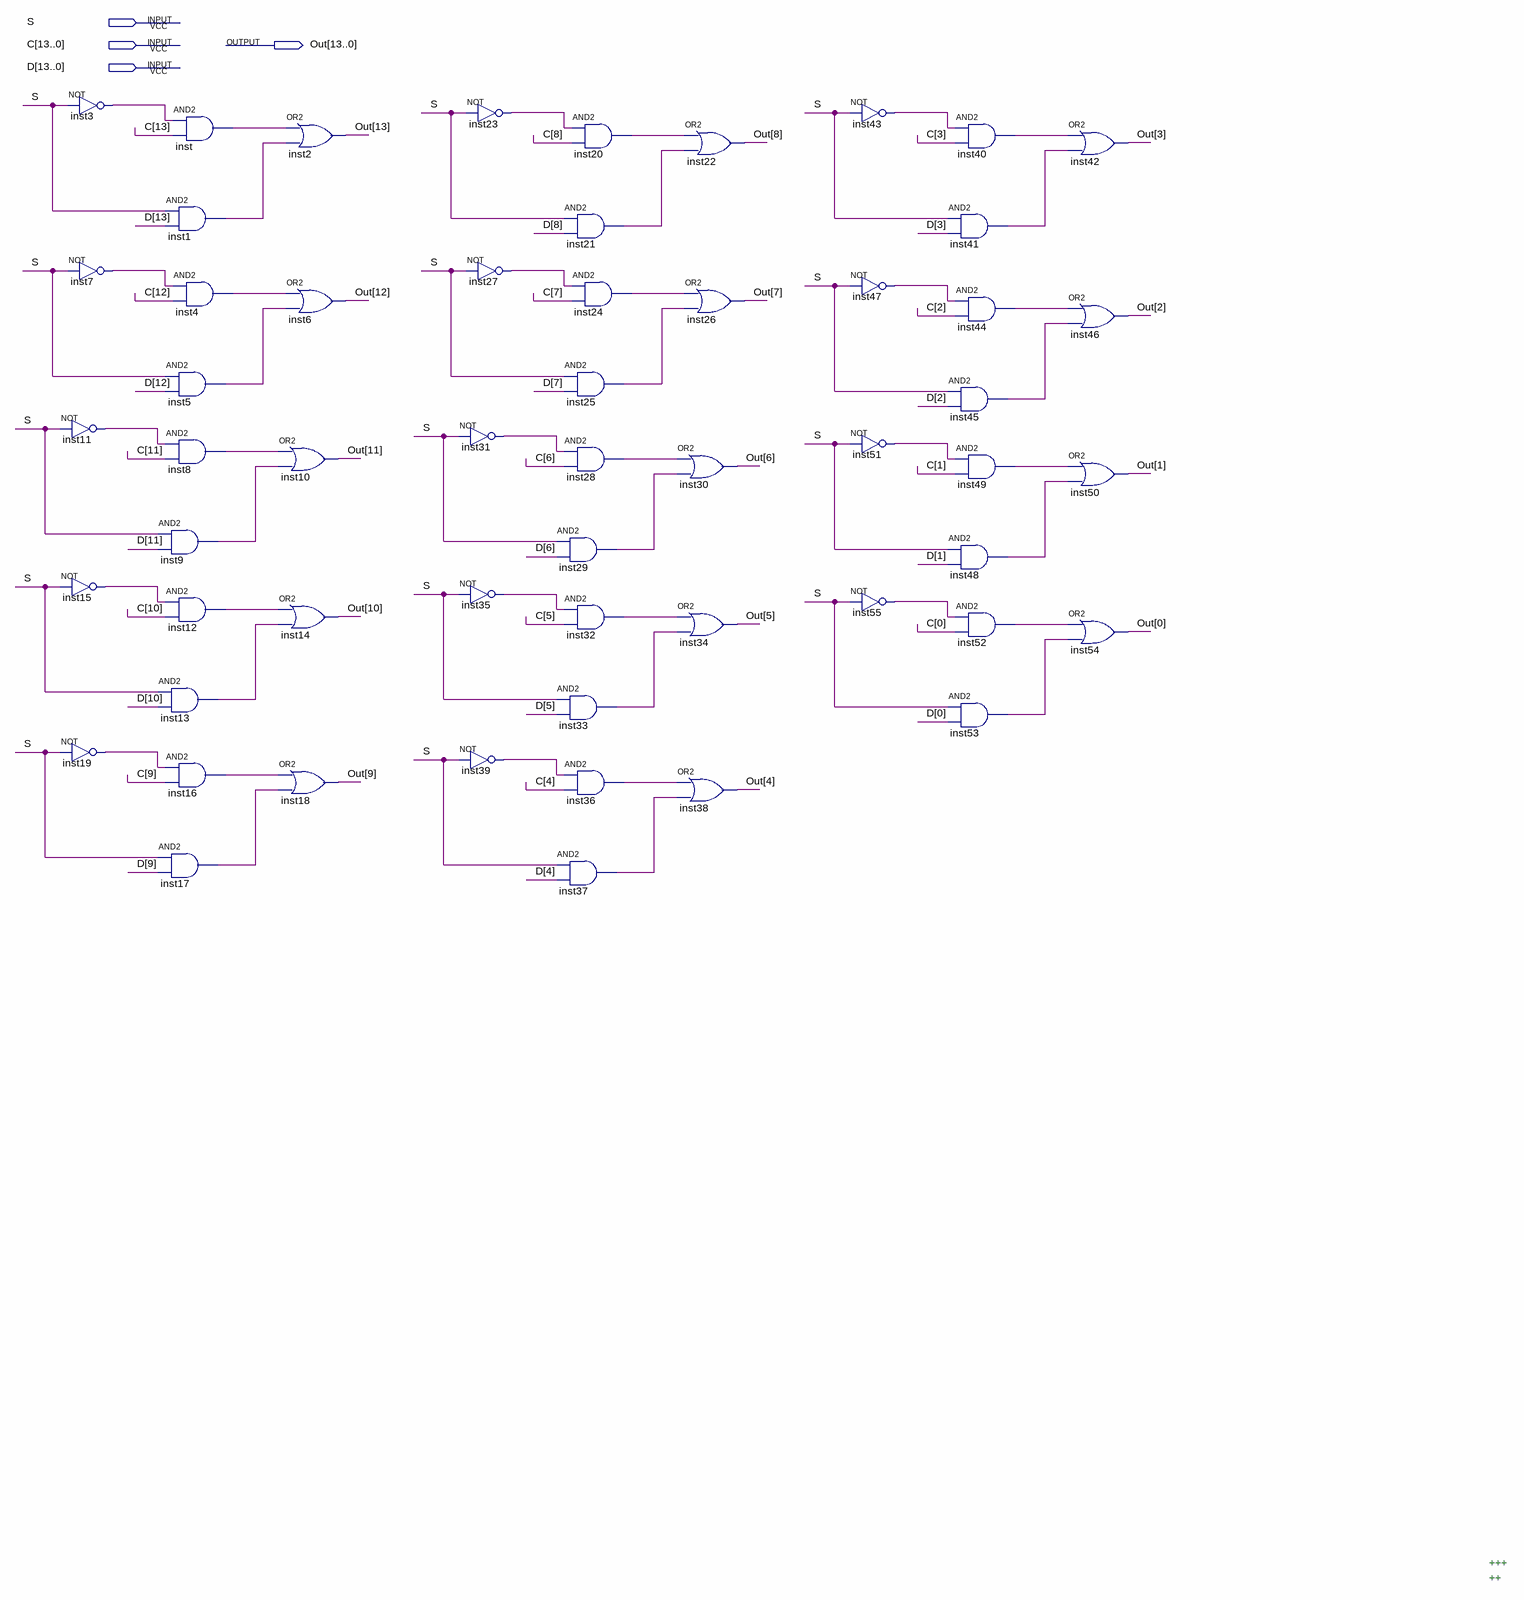
[diagram p0: schematic sheet]
// Quartus schematic g27_busmux.bdf as structural Verilog: 56 symbols, 4 pins
module g27_busmux (
  input  S,
  input  [13:0] C,
  input  [13:0] D,
  output [13:0] Out
);

  wire inst1_out, inst3_out, inst4_out, inst5_out, inst7_out, inst8_out, inst9_out, inst11_out, inst12_out,
       inst13_out, inst15_out, inst16_out, inst17_out, inst19_out, inst20_out, inst21_out, inst23_out,
       inst24_out, inst25_out, inst27_out, inst28_out, inst29_out, inst31_out, inst32_out, inst33_out,
       inst35_out, inst36_out, inst37_out, inst39_out, inst40_out, inst41_out, inst43_out, inst44_out,
       inst45_out, inst47_out, inst48_out, inst49_out, inst51_out, inst52_out, inst53_out, inst55_out,
       inst_out;

  not inst3 (inst3_out, S);
  not inst7 (inst7_out, S);
  not inst11 (inst11_out, S);
  not inst15 (inst15_out, S);
  not inst19 (inst19_out, S);
  and inst (inst_out, inst3_out, C[13]);
  and inst1 (inst1_out, S, D[13]);
  and inst4 (inst4_out, inst7_out, C[12]);
  and inst5 (inst5_out, S, D[12]);
  and inst8 (inst8_out, inst11_out, C[11]);
  and inst9 (inst9_out, S, D[11]);
  and inst12 (inst12_out, inst15_out, C[10]);
  and inst13 (inst13_out, S, D[10]);
  and inst16 (inst16_out, inst19_out, C[9]);
  and inst17 (inst17_out, S, D[9]);
  or inst2 (Out[13], inst_out, inst1_out);
  or inst6 (Out[12], inst4_out, inst5_out);
  or inst10 (Out[11], inst8_out, inst9_out);
  or inst14 (Out[10], inst12_out, inst13_out);
  or inst18 (Out[9], inst16_out, inst17_out);
  not inst23 (inst23_out, S);
  not inst27 (inst27_out, S);
  not inst31 (inst31_out, S);
  not inst35 (inst35_out, S);
  not inst39 (inst39_out, S);
  and inst20 (inst20_out, inst23_out, C[8]);
  and inst21 (inst21_out, S, D[8]);
  and inst24 (inst24_out, inst27_out, C[7]);
  and inst25 (inst25_out, S, D[7]);
  and inst28 (inst28_out, inst31_out, C[6]);
  and inst29 (inst29_out, S, D[6]);
  and inst32 (inst32_out, inst35_out, C[5]);
  and inst33 (inst33_out, S, D[5]);
  and inst36 (inst36_out, inst39_out, C[4]);
  and inst37 (inst37_out, S, D[4]);
  or inst22 (Out[8], inst20_out, inst21_out);
  or inst26 (Out[7], inst24_out, inst25_out);
  or inst30 (Out[6], inst28_out, inst29_out);
  or inst34 (Out[5], inst32_out, inst33_out);
  or inst38 (Out[4], inst36_out, inst37_out);
  not inst43 (inst43_out, S);
  not inst47 (inst47_out, S);
  not inst51 (inst51_out, S);
  not inst55 (inst55_out, S);
  and inst40 (inst40_out, inst43_out, C[3]);
  and inst41 (inst41_out, S, D[3]);
  and inst44 (inst44_out, inst47_out, C[2]);
  and inst45 (inst45_out, S, D[2]);
  and inst49 (inst49_out, inst51_out, C[1]);
  and inst48 (inst48_out, S, D[1]);
  and inst52 (inst52_out, inst55_out, C[0]);
  and inst53 (inst53_out, S, D[0]);
  or inst42 (Out[3], inst40_out, inst41_out);
  or inst46 (Out[2], inst44_out, inst45_out);
  or inst50 (Out[1], inst49_out, inst48_out);
  or inst54 (Out[0], inst52_out, inst53_out);

  // Notes on the sheet:
  //   +++
  //   ++
endmodule
